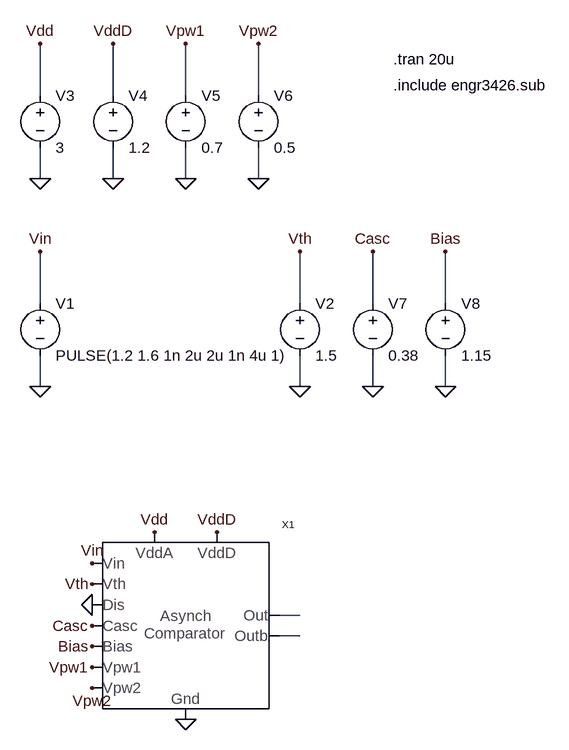
[diagram p0: schematic comparator_test.asc]
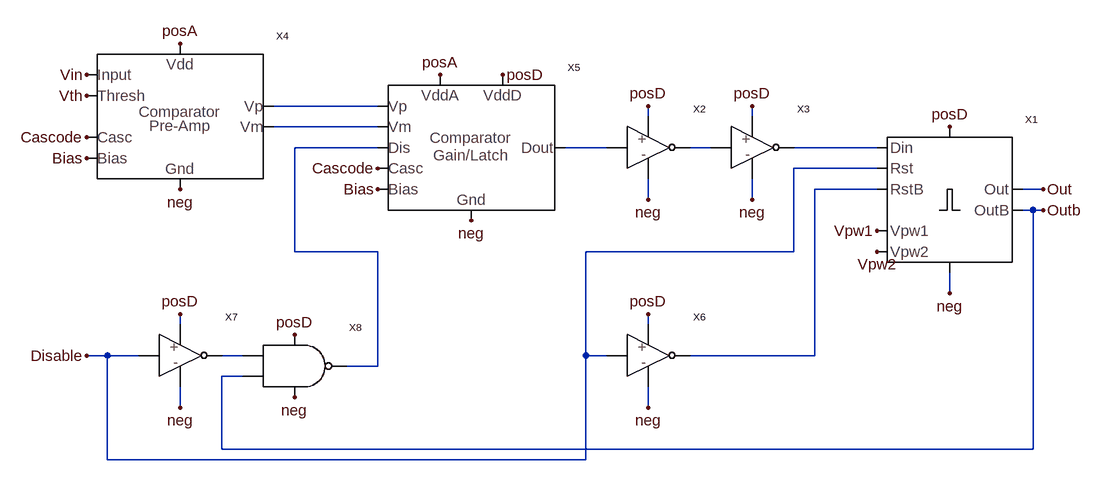
[diagram p1: sub-circuit comparator.asc]
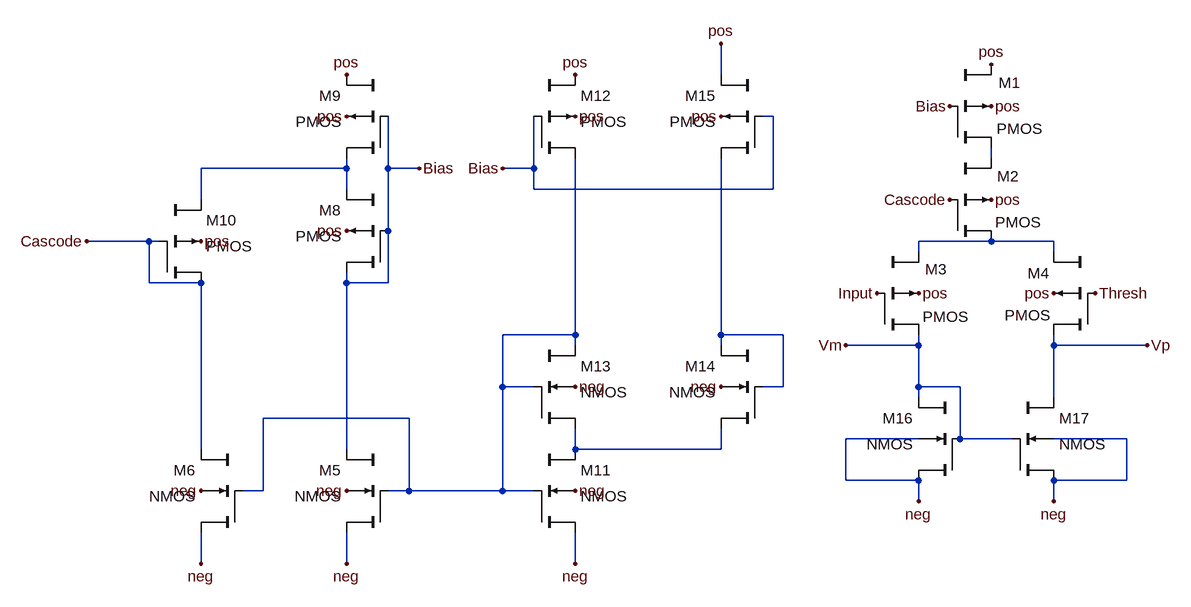
[diagram p2: sub-circuit comparator_preamp.asc]
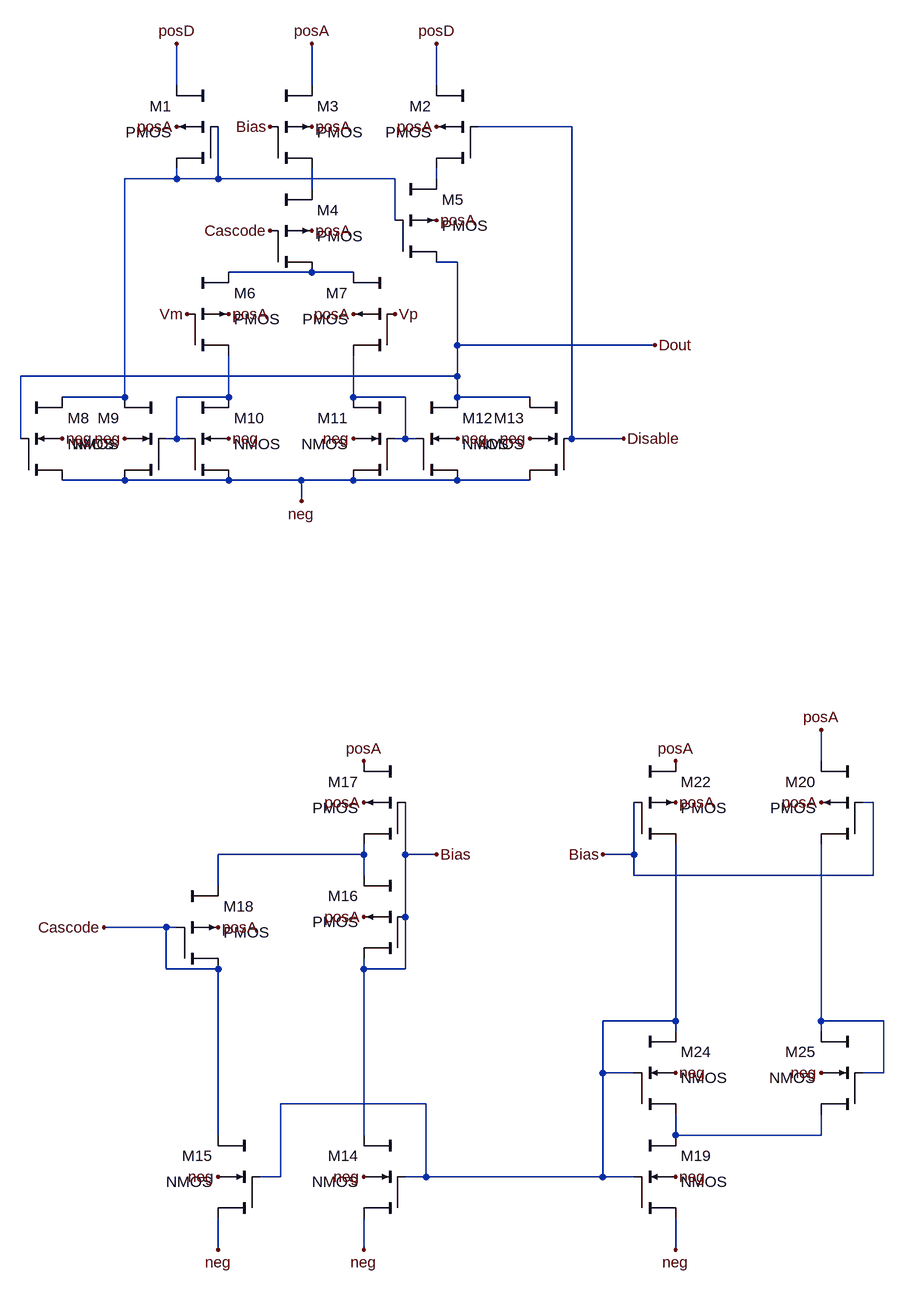
[diagram p3: sub-circuit comparator_gainlatch.asc]
comparator_test.asc, the LTspice schematic file:
Version 4
SHEET 1 880 832
WIRE -800 -592 -800 -672
WIRE -688 -592 -688 -672
WIRE -576 -592 -576 -672
WIRE -464 -592 -464 -672
WIRE -800 -464 -800 -512
WIRE -688 -464 -688 -512
WIRE -576 -464 -576 -512
WIRE -464 -464 -464 -512
WIRE -800 -272 -800 -352
WIRE -400 -272 -400 -352
WIRE -288 -272 -288 -352
WIRE -176 -272 -176 -352
WIRE -800 -144 -800 -192
WIRE -400 -144 -400 -192
WIRE -288 -144 -288 -192
WIRE -176 -144 -176 -192
WIRE -400 208 -432 208
WIRE -400 240 -432 240
FLAG -800 -144 0
FLAG -800 -352 Vin
FLAG -400 -144 0
FLAG -400 -352 Vth
FLAG -800 -464 0
FLAG -800 -672 Vdd
FLAG -688 -464 0
FLAG -688 -672 VddD
FLAG -576 -464 0
FLAG -576 -672 Vpw1
FLAG -464 -464 0
FLAG -464 -672 Vpw2
FLAG -720 160 Vth
FLAG -720 128 Vin
FLAG -720 192 0
FLAG -576 368 0
FLAG -624 80 Vdd
FLAG -528 80 VddD
FLAG -720 256 Bias
FLAG -720 224 Casc
FLAG -720 320 Vpw2
FLAG -720 288 Vpw1
FLAG -288 -144 0
FLAG -288 -352 Casc
FLAG -176 -144 0
FLAG -176 -352 Bias
SYMBOL voltage -800 -288 R0
WINDOW 123 0 0 Left 2
WINDOW 39 0 0 Left 2
SYMATTR InstName V1
SYMATTR Value PULSE(1.2 1.6 1n 2u 2u 1n 4u 1)
SYMBOL voltage -400 -288 R0
WINDOW 123 0 0 Left 2
WINDOW 39 0 0 Left 2
SYMATTR InstName V2
SYMATTR Value 1.5
SYMBOL voltage -800 -608 R0
WINDOW 123 0 0 Left 2
WINDOW 39 0 0 Left 2
SYMATTR InstName V3
SYMATTR Value 3
SYMBOL voltage -688 -608 R0
WINDOW 123 0 0 Left 2
WINDOW 39 0 0 Left 2
SYMATTR InstName V4
SYMATTR Value 1.2
SYMBOL voltage -576 -608 R0
WINDOW 123 0 0 Left 2
WINDOW 39 0 0 Left 2
SYMATTR InstName V5
SYMATTR Value 0.7
SYMBOL voltage -464 -608 R0
WINDOW 123 0 0 Left 2
WINDOW 39 0 0 Left 2
SYMATTR InstName V6
SYMATTR Value 0.5
SYMBOL comparator -576 224 R0
SYMATTR InstName X1
SYMBOL voltage -288 -288 R0
WINDOW 123 0 0 Left 2
WINDOW 39 0 0 Left 2
SYMATTR InstName V7
SYMATTR Value 0.38
SYMBOL voltage -176 -288 R0
WINDOW 123 0 0 Left 2
WINDOW 39 0 0 Left 2
SYMATTR InstName V8
SYMATTR Value 1.15
TEXT -256 -608 Left 2 !.include engr3426.sub
TEXT -256 -648 Left 2 !.tran 20u

comparator.asc, the sub-circuit schematic file:
Version 4
SHEET 1 1636 1340
WIRE 528 784 368 784
WIRE 944 800 944 784
WIRE 1104 800 1104 784
WIRE 528 816 368 816
WIRE 528 848 400 848
WIRE 880 848 816 848
WIRE 1040 848 1008 848
WIRE 1296 848 1168 848
WIRE 1296 880 1168 880
WIRE 1296 912 1200 912
WIRE 1552 912 1520 912
WIRE 944 928 944 896
WIRE 1104 928 1104 896
WIRE 1536 944 1520 944
WIRE 1552 944 1536 944
WIRE 400 1008 400 848
WIRE 528 1008 400 1008
WIRE 1168 1008 1168 880
WIRE 1168 1008 848 1008
WIRE 1408 1072 1408 1040
WIRE 224 1120 224 1104
WIRE 944 1120 944 1104
WIRE 112 1168 80 1168
WIRE 160 1168 112 1168
WIRE 320 1168 288 1168
WIRE 848 1168 848 1008
WIRE 880 1168 848 1168
WIRE 1200 1168 1200 912
WIRE 1200 1168 1008 1168
WIRE 528 1184 528 1008
WIRE 528 1184 480 1184
WIRE 320 1200 288 1200
WIRE 224 1248 224 1216
WIRE 944 1248 944 1216
WIRE 288 1312 288 1200
WIRE 1536 1312 1536 944
WIRE 1536 1312 288 1312
WIRE 112 1328 112 1168
WIRE 848 1328 848 1168
WIRE 848 1328 112 1328
FLAG 80 832 Cascode
FLAG 80 864 Bias
FLAG 528 912 Bias
FLAG 528 880 Cascode
FLAG 624 736 posA
FLAG 224 688 posA
FLAG 80 768 Vth
FLAG 80 736 Vin
FLAG 720 736 posD
FLAG 1408 816 posD
FLAG 1296 1008 Vpw2
FLAG 1296 976 Vpw1
FLAG 944 784 posD
FLAG 1104 784 posD
FLAG 1552 912 Out
FLAG 1552 944 Outb
FLAG 80 1168 Disable
FLAG 944 1104 posD
FLAG 224 912 neg
FLAG 672 960 neg
FLAG 944 928 neg
FLAG 1104 928 neg
FLAG 1408 1072 neg
FLAG 944 1248 neg
FLAG 224 1104 posD
FLAG 224 1248 neg
FLAG 400 1232 neg
FLAG 400 1136 posD
SYMBOL pulse_width_control 1408 928 R0
SYMATTR InstName X1
SYMATTR SpiceLine A=0.3u
SYMBOL Inverter 944 848 R0
SYMATTR InstName X2
SYMATTR SpiceLine nmosL=0.9u nmosW=3u pmosL=0.9u pmosW=6u
SYMBOL Inverter 1104 848 R0
SYMATTR InstName X3
SYMATTR SpiceLine nmosL=0.9u nmosW=3u pmosL=0.9u pmosW=6u
SYMBOL comparator_preamp 224 800 R0
SYMATTR InstName X4
SYMBOL comparator_gainlatch 672 848 R0
SYMATTR InstName X5
SYMBOL Inverter 944 1168 R0
SYMATTR InstName X6
SYMATTR SpiceLine nmosL=0.9u nmosW=3u pmosL=0.9u pmosW=6u
SYMBOL Inverter 224 1168 R0
SYMATTR InstName X7
SYMATTR SpiceLine nmosL=0.9u nmosW=3u pmosL=0.9u pmosW=6u
SYMBOL NAND 400 1184 R0
SYMATTR InstName X8
SYMATTR SpiceLine nmosL=0.9u nmosW=3u pmosL=0.9u pmosW=6u

comparator_preamp.asc, the sub-circuit schematic file:
Version 4
SHEET 1 1144 1268
WIRE -864 -32 -864 -80
WIRE -784 32 -800 32
WIRE -448 96 -448 80
WIRE -1440 112 -1440 96
WIRE -1440 112 -1664 112
WIRE -1376 112 -1376 32
WIRE -1328 112 -1376 112
WIRE -1152 112 -1152 32
WIRE -1152 112 -1200 112
WIRE -1440 144 -1440 112
WIRE -1152 144 -1152 112
WIRE -784 144 -784 32
WIRE -784 144 -1152 144
WIRE -1664 160 -1664 112
WIRE -1376 208 -1376 112
WIRE -1744 224 -1840 224
WIRE -1728 224 -1744 224
WIRE -448 224 -560 224
WIRE -352 224 -448 224
WIRE -560 240 -560 224
WIRE -352 240 -352 224
WIRE -1744 288 -1744 224
WIRE -1664 288 -1744 288
WIRE -1440 288 -1440 272
WIRE -1376 288 -1376 208
WIRE -1376 288 -1440 288
WIRE -1088 368 -1088 96
WIRE -1088 368 -1200 368
WIRE -864 368 -864 96
WIRE -768 368 -864 368
WIRE -1088 384 -1088 368
WIRE -864 384 -864 368
WIRE -560 384 -560 368
WIRE -560 384 -672 384
WIRE -352 384 -352 368
WIRE -208 384 -352 384
WIRE -1200 448 -1200 368
WIRE -1152 448 -1200 448
WIRE -768 448 -768 368
WIRE -768 448 -800 448
WIRE -560 448 -560 384
WIRE -496 448 -560 448
WIRE -560 464 -560 448
WIRE -352 464 -352 384
WIRE -1344 496 -1568 496
WIRE -560 528 -672 528
WIRE -496 528 -496 448
WIRE -416 528 -496 528
WIRE -240 528 -352 528
WIRE -1664 544 -1664 288
WIRE -1440 544 -1440 288
WIRE -1088 544 -1088 512
WIRE -864 544 -864 512
WIRE -864 544 -1088 544
WIRE -672 592 -672 528
WIRE -560 592 -672 592
WIRE -240 592 -240 528
WIRE -240 592 -352 592
WIRE -1568 608 -1568 496
WIRE -1568 608 -1600 608
WIRE -1344 608 -1344 496
WIRE -1344 608 -1376 608
WIRE -1200 608 -1200 448
WIRE -1200 608 -1344 608
WIRE -1152 608 -1200 608
WIRE -560 624 -560 592
WIRE -352 624 -352 592
WIRE -1664 720 -1664 672
WIRE -1440 720 -1440 672
WIRE -1088 720 -1088 672
FLAG -560 304 pos
FLAG -352 304 pos
FLAG -448 160 pos
FLAG -448 16 pos
FLAG -448 -48 pos
FLAG -624 304 Input
FLAG -288 304 Thresh
FLAG -512 160 Cascode
FLAG -512 16 Bias
FLAG -208 384 Vp
FLAG -672 384 Vm
FLAG -1440 608 neg
FLAG -1664 608 neg
FLAG -1440 720 neg
FLAG -1664 720 neg
FLAG -1440 208 pos
FLAG -1440 32 pos
FLAG -1440 -32 pos
FLAG -1664 224 pos
FLAG -1840 224 Cascode
FLAG -1328 112 Bias
FLAG -1088 608 neg
FLAG -1088 720 neg
FLAG -1088 32 pos
FLAG -1088 -32 pos
FLAG -1200 112 Bias
FLAG -1088 448 neg
FLAG -864 448 neg
FLAG -864 32 pos
FLAG -864 -80 pos
FLAG -560 624 neg
FLAG -352 624 neg
SYMBOL cktsym\\pmos4 -448 16 R0
WINDOW 0 11 -36 Left 2
WINDOW 3 8 35 Left 2
SYMATTR InstName M1
SYMATTR Value2 l=4u w=16u
SYMBOL cktsym\\pmos4 -448 160 R0
WINDOW 0 9 -36 Left 2
WINDOW 3 6 35 Left 2
SYMATTR InstName M2
SYMATTR Value2 l=.8u w=3.2u
SYMBOL cktsym\\pmos4 -560 304 R0
WINDOW 0 10 -37 Left 2
WINDOW 3 6 36 Left 2
SYMATTR InstName M3
SYMATTR Value2 l=1u w=3u
SYMBOL cktsym\\pmos4 -352 304 M0
WINDOW 0 6 -31 Left 2
WINDOW 3 5 34 Left 2
SYMATTR InstName M4
SYMATTR Value2 l=1u w=3u
SYMBOL cktsym\\nmos4 -1440 608 M0
SYMATTR InstName M5
SYMATTR Value2 l=4u w=0.9u
SYMBOL cktsym\\nmos4 -1664 608 M0
SYMATTR InstName M6
SYMATTR Value2 l=4u w=4u
SYMBOL cktsym\\pmos4 -1440 208 M0
SYMATTR InstName M8
SYMATTR Value2 l=1u w=16u
SYMBOL cktsym\\pmos4 -1440 32 M0
SYMATTR InstName M9
SYMATTR Value2 l=4u w=16u
SYMBOL cktsym\\pmos4 -1664 224 R0
SYMATTR InstName M10
SYMATTR Value2 l=4u w=16u
SYMBOL cktsym\\nmos4 -1088 608 R0
SYMATTR InstName M11
SYMATTR Value2 l=4u w=4u
SYMBOL cktsym\\pmos4 -1088 32 R0
SYMATTR InstName M12
SYMATTR Value2 l=4u w=3.2u
SYMBOL cktsym\\nmos4 -1088 448 R0
SYMATTR InstName M13
SYMATTR Value2 l=4u w=16u
SYMBOL cktsym\\nmos4 -864 448 M0
SYMATTR InstName M14
SYMATTR Value2 l=4u w=4u
SYMBOL cktsym\\pmos4 -864 32 M0
SYMATTR InstName M15
SYMATTR Value2 l=4u w=16u
SYMBOL cktsym\\nmos4 -560 528 M0
SYMATTR InstName M16
SYMATTR Value2 l=0.9u w=3u
SYMBOL cktsym\\nmos4 -352 528 R0
SYMATTR InstName M17
SYMATTR Value2 l=0.9u w=3u

comparator_gainlatch.asc, the sub-circuit schematic file:
Version 4
SHEET 1 1328 1948
WIRE 32 48 32 -16
WIRE 240 48 240 -16
WIRE 432 48 432 -16
WIRE 640 112 496 112
WIRE 32 192 32 176
WIRE 32 192 -48 192
WIRE 96 192 96 112
WIRE 96 192 32 192
WIRE 368 192 96 192
WIRE 432 192 432 176
WIRE 240 208 240 176
WIRE 368 256 368 192
WIRE 464 320 432 320
WIRE 240 336 112 336
WIRE 304 336 240 336
WIRE 464 448 464 320
WIRE 768 448 464 448
WIRE 464 496 464 448
WIRE 464 496 -208 496
WIRE -48 528 -48 192
WIRE -48 528 -144 528
WIRE 112 528 112 464
WIRE 112 528 32 528
WIRE 304 528 304 464
WIRE 384 528 304 528
WIRE 464 528 464 496
WIRE 576 528 464 528
WIRE -208 592 -208 496
WIRE 32 592 32 528
WIRE 32 592 16 592
WIRE 48 592 32 592
WIRE 384 592 384 528
WIRE 384 592 368 592
WIRE 400 592 384 592
WIRE 640 592 640 112
WIRE 720 592 640 592
WIRE -48 656 -144 656
WIRE 112 656 -48 656
WIRE 224 656 112 656
WIRE 304 656 224 656
WIRE 464 656 304 656
WIRE 576 656 464 656
WIRE 224 688 224 656
WIRE 1024 1088 1024 1040
WIRE 1104 1152 1088 1152
WIRE 320 1232 320 1216
WIRE 320 1232 96 1232
WIRE 384 1232 384 1152
WIRE 432 1232 384 1232
WIRE 736 1232 736 1152
WIRE 736 1232 688 1232
WIRE 320 1264 320 1232
WIRE 736 1264 736 1232
WIRE 1104 1264 1104 1152
WIRE 1104 1264 736 1264
WIRE 96 1280 96 1232
WIRE 384 1328 384 1232
WIRE 16 1344 -80 1344
WIRE 32 1344 16 1344
WIRE 16 1408 16 1344
WIRE 96 1408 16 1408
WIRE 320 1408 320 1392
WIRE 384 1408 384 1328
WIRE 384 1408 320 1408
WIRE 800 1488 800 1216
WIRE 800 1488 688 1488
WIRE 1024 1488 1024 1216
WIRE 1120 1488 1024 1488
WIRE 800 1504 800 1488
WIRE 1024 1504 1024 1488
WIRE 688 1568 688 1488
WIRE 736 1568 688 1568
WIRE 1120 1568 1120 1488
WIRE 1120 1568 1088 1568
WIRE 416 1616 192 1616
WIRE 96 1664 96 1408
WIRE 320 1664 320 1408
WIRE 800 1664 800 1632
WIRE 1024 1664 1024 1632
WIRE 1024 1664 800 1664
WIRE 192 1728 192 1616
WIRE 192 1728 160 1728
WIRE 416 1728 416 1616
WIRE 416 1728 384 1728
WIRE 688 1728 688 1568
WIRE 688 1728 416 1728
WIRE 736 1728 688 1728
WIRE 96 1840 96 1792
WIRE 320 1840 320 1792
WIRE 800 1840 800 1792
FLAG 32 112 posA
FLAG 240 112 posA
FLAG 432 112 posA
FLAG 240 272 posA
FLAG 432 256 posA
FLAG 112 400 posA
FLAG 304 400 posA
FLAG -48 592 neg
FLAG -144 592 neg
FLAG 112 592 neg
FLAG 304 592 neg
FLAG 464 592 neg
FLAG 576 592 neg
FLAG 368 400 Vp
FLAG 48 400 Vm
FLAG 224 688 neg
FLAG 720 592 Disable
FLAG 768 448 Dout
FLAG 240 -16 posA
FLAG 176 272 Cascode
FLAG 176 112 Bias
FLAG 320 1728 neg
FLAG 96 1728 neg
FLAG 320 1840 neg
FLAG 96 1840 neg
FLAG 320 1328 posA
FLAG 320 1152 posA
FLAG 320 1088 posA
FLAG 96 1344 posA
FLAG -80 1344 Cascode
FLAG 432 1232 Bias
FLAG 800 1728 neg
FLAG 800 1840 neg
FLAG 800 1152 posA
FLAG 800 1088 posA
FLAG 688 1232 Bias
FLAG 800 1568 neg
FLAG 1024 1568 neg
FLAG 1024 1152 posA
FLAG 1024 1040 posA
FLAG 32 -16 posD
FLAG 432 -16 posD
SYMBOL cktsym\\pmos4 32 112 M0
SYMATTR InstName M1
SYMATTR Value2 l=2.7u w=9u
SYMBOL cktsym\\pmos4 240 112 R0
SYMATTR InstName M3
SYMATTR Value2 l=18u w=18u
SYMBOL cktsym\\pmos4 432 112 M0
SYMATTR InstName M2
SYMATTR Value2 l=2.7u w=9u
SYMBOL cktsym\\pmos4 240 272 R0
SYMATTR InstName M4
SYMATTR Value2 l=4.5u w=4.5u
SYMBOL cktsym\\pmos4 432 256 R0
SYMATTR InstName M5
SYMATTR Value2 l=2u w=.6u
SYMBOL cktsym\\pmos4 112 400 R0
SYMATTR InstName M6
SYMATTR Value2 l=3.6u w=7.2u
SYMBOL cktsym\\pmos4 304 400 M0
SYMATTR InstName M7
SYMATTR Value2 l=3.6u w=7.2u
SYMBOL cktsym\\nmos4 -144 592 R0
SYMATTR InstName M8
SYMATTR Value2 l=1.8u w=7.2u
SYMBOL cktsym\\nmos4 -48 592 M0
SYMATTR InstName M9
SYMATTR Value2 l=4.5u w=2.7u
SYMBOL cktsym\\nmos4 112 592 R0
SYMATTR InstName M10
SYMATTR Value2 l=4.5u w=2.7u
SYMBOL cktsym\\nmos4 304 592 M0
SYMATTR InstName M11
SYMATTR Value2 l=4.5u w=2.7u
SYMBOL cktsym\\nmos4 464 592 R0
SYMATTR InstName M12
SYMATTR Value2 l=4.5u w=2.7u
SYMBOL cktsym\\nmos4 576 592 M0
SYMATTR InstName M13
SYMATTR Value2 l=1.8u w=7.2u
SYMBOL cktsym\\nmos4 320 1728 M0
SYMATTR InstName M14
SYMATTR Value2 l=4u w=0.8u
SYMBOL cktsym\\nmos4 96 1728 M0
SYMATTR InstName M15
SYMATTR Value2 l=4u w=4u
SYMBOL cktsym\\pmos4 320 1328 M0
SYMATTR InstName M16
SYMATTR Value2 l=1.8u w=6.4u
SYMBOL cktsym\\pmos4 320 1152 M0
SYMATTR InstName M17
SYMATTR Value2 l=1.8u w=1.8u
SYMBOL cktsym\\pmos4 96 1344 R0
SYMATTR InstName M18
SYMATTR Value2 l=1.8u w=1.8u
SYMBOL cktsym\\nmos4 800 1728 R0
SYMATTR InstName M19
SYMATTR Value2 l=4u w=4u
SYMBOL cktsym\\pmos4 800 1152 R0
SYMATTR InstName M22
SYMATTR Value2 l=1.8u w=0.36u
SYMBOL cktsym\\nmos4 800 1568 R0
SYMATTR InstName M24
SYMATTR Value2 l=4u w=16u
SYMBOL cktsym\\nmos4 1024 1568 M0
SYMATTR InstName M25
SYMATTR Value2 l=4u w=4u
SYMBOL cktsym\\pmos4 1024 1152 M0
SYMATTR InstName M20
SYMATTR Value2 l=1.8u w=1.8u

The netlist it stands for:
* comparator_test.asc
V1 Vin 0 PULSE(1.2 1.6 1n 2u 2u 1n 4u 1)
V2 Vth 0 1.5
V3 Vdd 0 3
V4 VddD 0 1.2
V5 Vpw1 0 0.7
V6 Vpw2 0 0.5
XX1 Vin Vth 0 Casc Bias Vpw1 Vpw2 Vdd VddD 0 N001 N002 comparator
V7 Casc 0 0.38
V8 Bias 0 1.15

* block symbol definitions
.subckt comparator Vin Vth Disable Cascode Bias Vpw1 Vpw2 posA posD neg Out Outb
XX1 N006 Disable N007 Vpw1 Vpw2 posD neg Out Outb pulse_width_control A=0.3u  ; pins Din Reset ResetB Vpw1 Vpw2 pos neg Out OutB
XX2 N004 N005 posD neg Inverter nmosL=0.9u nmosW=3u pmosL=0.9u pmosW=6u  ; pins IN OUT pos neg
XX3 N005 N006 posD neg Inverter nmosL=0.9u nmosW=3u pmosL=0.9u pmosW=6u  ; pins IN OUT pos neg
XX4 Vin Vth Cascode Bias posA neg N001 N002 comparator_preamp
XX5 N001 N002 N003 Cascode Bias posA posD neg N004 comparator_gainlatch
XX6 Disable N007 posD neg Inverter nmosL=0.9u nmosW=3u pmosL=0.9u pmosW=6u  ; pins IN OUT pos neg
XX7 Disable N008 posD neg Inverter nmosL=0.9u nmosW=3u pmosL=0.9u pmosW=6u  ; pins IN OUT pos neg
XX8 N008 N003 Outb posD neg NAND nmosL=0.9u nmosW=3u pmosL=0.9u pmosW=6u  ; pins A OUT B Vdd GROUND
.ends comparator

.subckt comparator_preamp Input Thresh Cascode Bias pos neg Vp Vm
M1 N001 Bias pos pos PMOS l=4u w=16u
M2 N003 Cascode N001 pos PMOS l=.8u w=3.2u
M3 Vm Input N003 pos PMOS l=1u w=3u
M4 Vp Thresh N003 pos PMOS l=1u w=3u
M5 Bias N004 neg neg NMOS l=4u w=0.9u
M6 Cascode N004 neg neg NMOS l=4u w=4u
M8 Bias Bias N002 pos PMOS l=1u w=16u
M9 N002 Bias pos pos PMOS l=4u w=16u
M10 Cascode Cascode N002 pos PMOS l=4u w=16u
M11 N006 N004 neg neg NMOS l=4u w=4u
M12 N004 Bias pos pos PMOS l=4u w=3.2u
M13 N004 N004 N006 neg NMOS l=4u w=16u
M14 N005 N005 N006 neg NMOS l=4u w=4u
M15 N005 Bias pos pos PMOS l=4u w=16u
M16 Vm Vm neg neg NMOS l=0.9u w=3u
M17 Vp Vm neg neg NMOS l=0.9u w=3u
.ends comparator_preamp

.subckt comparator_gainlatch Vp Vm Disable Cascode Bias posA posD neg Dout
M1 N001 N001 posD posA PMOS l=2.7u w=9u
M3 N003 Bias posA posA PMOS l=18u w=18u
M2 N002 Disable posD posA PMOS l=2.7u w=9u
M4 N004 Cascode N003 posA PMOS l=4.5u w=4.5u
M5 Dout N001 N002 posA PMOS l=2u w=.6u
M6 N005 Vm N004 posA PMOS l=3.6u w=7.2u
M7 N006 Vp N004 posA PMOS l=3.6u w=7.2u
M8 N001 Dout neg neg NMOS l=1.8u w=7.2u
M9 N001 N005 neg neg NMOS l=4.5u w=2.7u
M10 N005 N005 neg neg NMOS l=4.5u w=2.7u
M11 N006 N006 neg neg NMOS l=4.5u w=2.7u
M12 Dout N006 neg neg NMOS l=4.5u w=2.7u
M13 Dout Disable neg neg NMOS l=1.8u w=7.2u
M14 Bias N008 neg neg NMOS l=4u w=0.8u
M15 Cascode N008 neg neg NMOS l=4u w=4u
M16 Bias Bias N007 posA PMOS l=1.8u w=6.4u
M17 N007 Bias posA posA PMOS l=1.8u w=1.8u
M18 Cascode Cascode N007 posA PMOS l=1.8u w=1.8u
M19 N010 N008 neg neg NMOS l=4u w=4u
M22 N008 Bias posA posA PMOS l=1.8u w=0.36u
M24 N008 N008 N010 neg NMOS l=4u w=16u
M25 N009 N009 N010 neg NMOS l=4u w=4u
M20 N009 Bias posA posA PMOS l=1.8u w=1.8u
.ends comparator_gainlatch

.model NMOS NMOS
.model PMOS PMOS
.lib standard.mos
.include engr3426.sub
.tran 20u
.backanno
.end